# Altium schematic sheet LED&Button.SchDoc: =ProjectDescription
size 297 x 209 mm; Address1: Address1; Address2: Address2; Address3: Address3; Address4: Address4; SheetNumber: 7; SheetTotal: 7; Scale: 1:1; DocumentType: Схема электрическая принципиальная
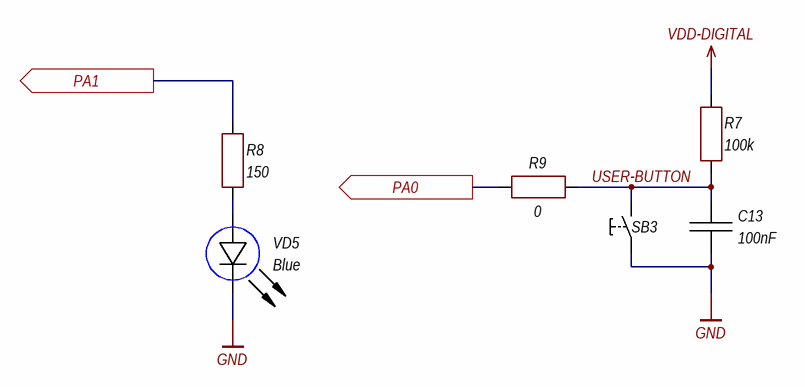
[diagram p0: LED&Button.SchDoc]

## Parts
C13  100nF  [CH0402C]
R7  100k  [CH0402R]
R8  150  [CH0402R]
R9  0  [CH0402R]
SB3  "Кнопка"  [BUT: YTS-A017]  (value not drawn)
VD5  Blue  [CH0402LG]

## Ports
PA0 (out), PA1 (out)

## Nets
GND: C13.1 SB3.1 VD5.2(C)
VDD-DIGITAL: R7.2
PA0: R9.1 ; port PA0
PA1: R8.2 ; port PA1
USER-BUTTON: C13.2 R7.1 R9.2 SB3.2
NetR8_1: R8.1 VD5.1(A)

## Notes on the sheet
- Изм.
- Лист
- № докум.
- Подп.
- Дата
- Копировал
- Формат А4

## Library data of the parts
C13 = Capacitor: Manufacturer: *; Model: *; HelpURL: *; ComponentKind: *; Value: 100nF
R7-R9 = Resistor: Manufacturer: *; Model: *; HelpURL: *; ComponentKind: *
  R7: Value: 100k
  R8: Value: 150
  R9: Value: 0
SB3 = 1-Button: Button, no latching; Manufacturer: *; Model: *; HelpURL: *; ComponentKind: *
VD5 = LED: Manufacturer: *; Model: *; HelpURL: *; ComponentKind: *; Value: Blue